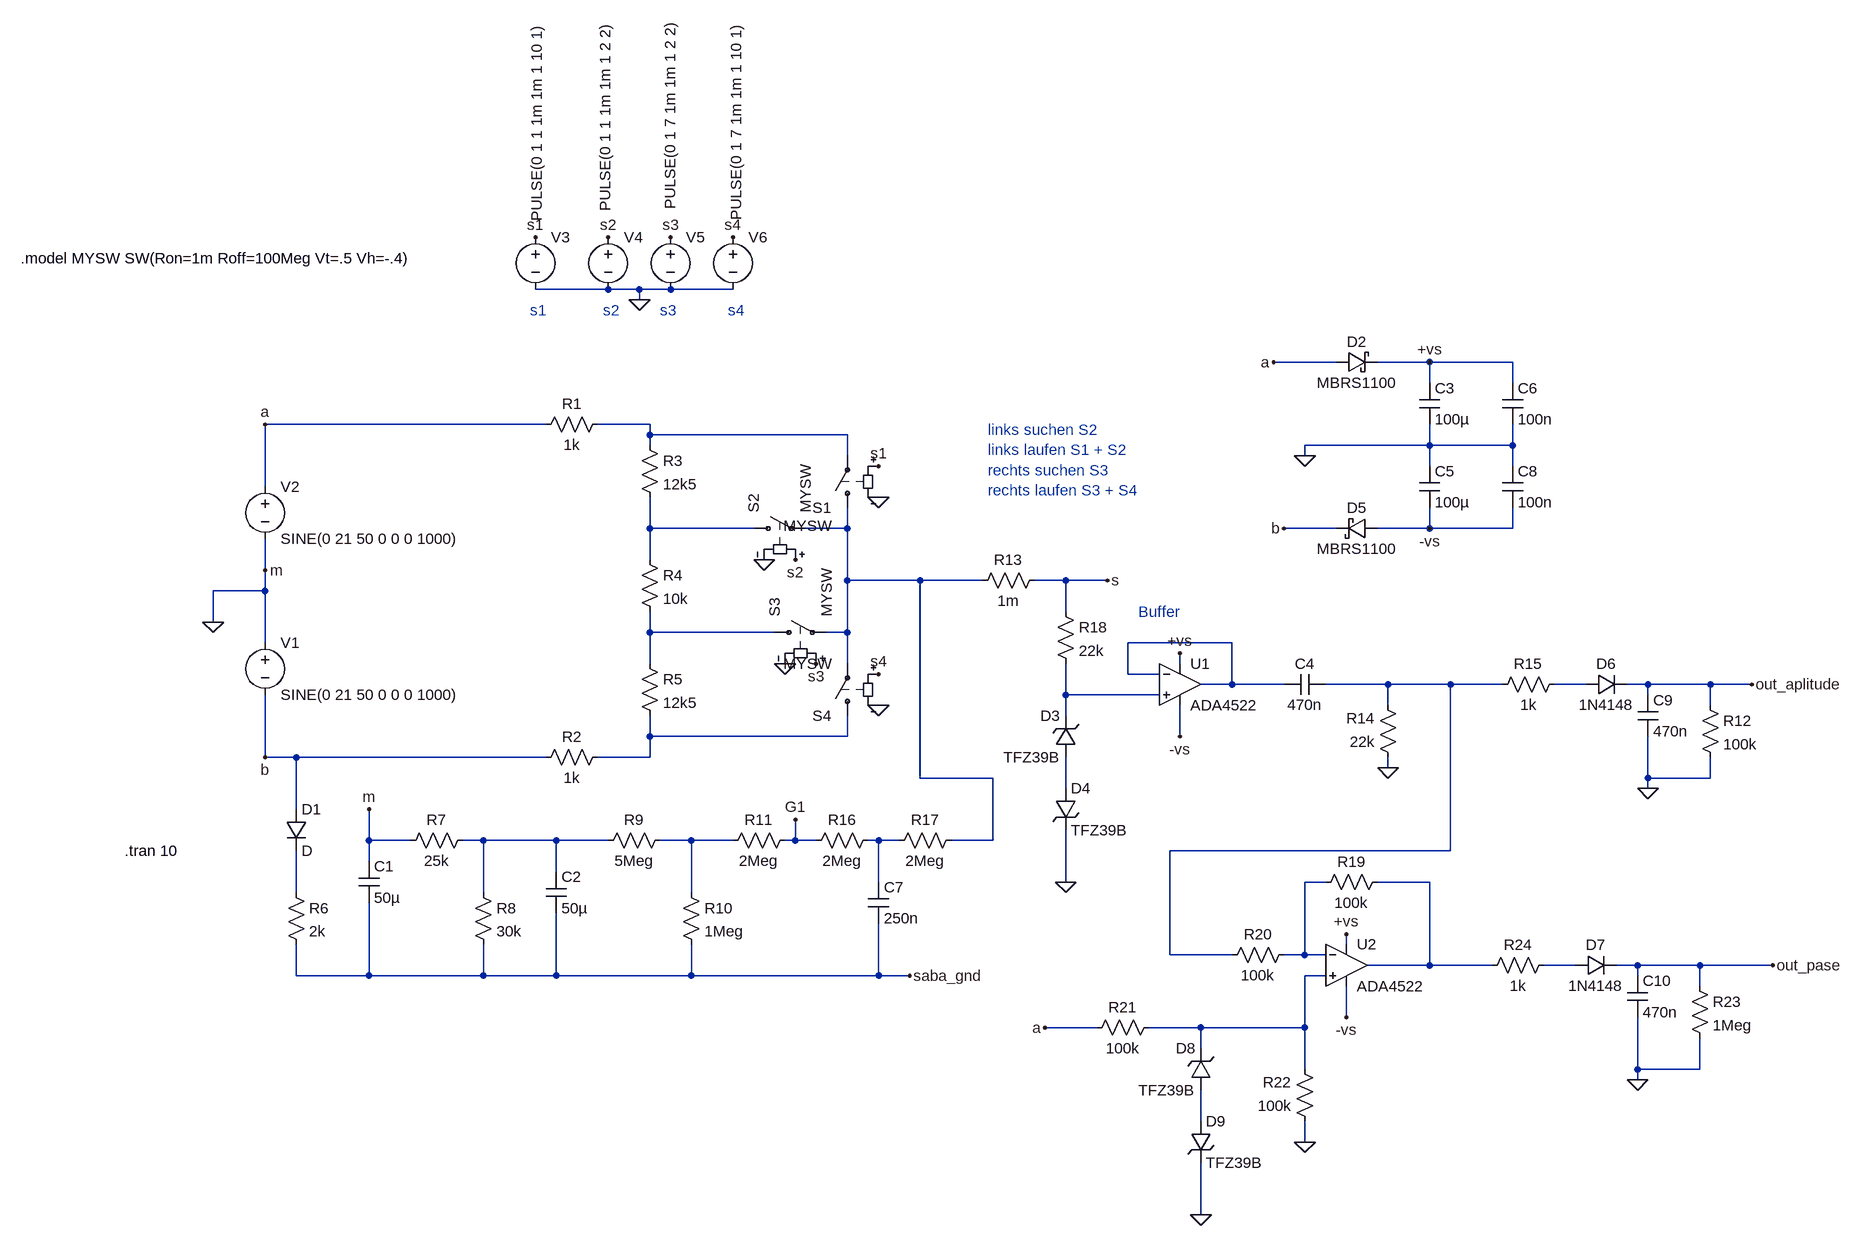
[diagram p0: schematic suchlauf_schalter_digital.asc]
suchlauf_schalter_digital.asc, the LTspice schematic file:
Version 4
SHEET 1 2972 1124
WIRE 592 -320 480 -320
WIRE 640 -320 592 -320
WIRE 688 -320 640 -320
WIRE 784 -320 688 -320
WIRE 640 -304 640 -320
WIRE 1712 -208 1616 -208
WIRE 1856 -208 1776 -208
WIRE 1984 -208 1856 -208
WIRE 1856 -176 1856 -208
WIRE 1984 -176 1984 -208
WIRE 496 -112 64 -112
WIRE 656 -112 576 -112
WIRE 656 -96 656 -112
WIRE 960 -96 656 -96
WIRE 656 -80 656 -96
WIRE 1856 -80 1856 -112
WIRE 1856 -80 1664 -80
WIRE 1984 -80 1984 -112
WIRE 1984 -80 1856 -80
WIRE 960 -64 960 -96
WIRE 1664 -64 1664 -80
WIRE 1856 -48 1856 -80
WIRE 1984 -48 1984 -80
WIRE 64 -16 64 -112
WIRE 656 48 656 0
WIRE 816 48 656 48
WIRE 960 48 960 16
WIRE 960 48 896 48
WIRE 1712 48 1632 48
WIRE 1856 48 1856 16
WIRE 1856 48 1776 48
WIRE 1984 48 1984 16
WIRE 1984 48 1856 48
WIRE 656 96 656 48
WIRE 64 112 64 64
WIRE 960 128 960 48
WIRE 1072 128 960 128
WIRE 1168 128 1072 128
WIRE 1296 128 1248 128
WIRE 1360 128 1296 128
WIRE 64 144 64 112
WIRE 64 144 -16 144
WIRE 1296 176 1296 128
WIRE -16 192 -16 144
WIRE 656 208 656 176
WIRE 848 208 656 208
WIRE 960 208 960 128
WIRE 960 208 928 208
WIRE 64 224 64 144
WIRE 1552 224 1392 224
WIRE 656 256 656 208
WIRE 960 256 960 208
WIRE 1472 256 1472 240
WIRE 1392 272 1392 224
WIRE 1440 272 1392 272
WIRE 1552 288 1552 224
WIRE 1552 288 1504 288
WIRE 1632 288 1552 288
WIRE 1792 288 1696 288
WIRE 1888 288 1792 288
WIRE 1968 288 1888 288
WIRE 2096 288 2048 288
WIRE 2192 288 2160 288
WIRE 2288 288 2192 288
WIRE 2352 288 2288 288
WIRE 1296 304 1296 256
WIRE 1440 304 1296 304
WIRE 2192 304 2192 288
WIRE 1792 320 1792 288
WIRE 2288 320 2288 288
WIRE 1296 336 1296 304
WIRE 656 368 656 336
WIRE 960 368 960 336
WIRE 960 368 656 368
WIRE 1472 368 1472 320
WIRE 64 400 64 304
WIRE 112 400 64 400
WIRE 496 400 112 400
WIRE 656 400 656 368
WIRE 656 400 576 400
WIRE 1792 416 1792 400
WIRE 1072 432 1072 128
WIRE 1184 432 1072 432
WIRE 2192 432 2192 368
WIRE 2288 432 2288 400
WIRE 2288 432 2192 432
WIRE 1296 448 1296 400
WIRE 2192 448 2192 432
WIRE 112 480 112 400
WIRE 224 528 224 480
WIRE 288 528 224 528
WIRE 400 528 368 528
WIRE 512 528 400 528
WIRE 592 528 512 528
WIRE 720 528 672 528
WIRE 784 528 720 528
WIRE 880 528 880 496
WIRE 880 528 864 528
WIRE 912 528 880 528
WIRE 1008 528 992 528
WIRE 1040 528 1008 528
WIRE 1184 528 1184 432
WIRE 1184 528 1120 528
WIRE 1888 544 1888 288
WIRE 1888 544 1456 544
WIRE 224 560 224 528
WIRE 512 576 512 528
WIRE 1008 592 1008 528
WIRE 1296 592 1296 512
WIRE 1696 592 1664 592
WIRE 1856 592 1776 592
WIRE 112 608 112 544
WIRE 400 608 400 528
WIRE 720 608 720 528
WIRE 1728 688 1728 672
WIRE 1456 704 1456 544
WIRE 1552 704 1456 704
WIRE 1664 704 1664 592
WIRE 1664 704 1632 704
WIRE 1696 704 1664 704
WIRE 1856 720 1856 592
WIRE 1856 720 1760 720
WIRE 1952 720 1856 720
WIRE 2080 720 2032 720
WIRE 2176 720 2144 720
WIRE 2272 720 2176 720
WIRE 2384 720 2272 720
WIRE 112 736 112 688
WIRE 224 736 224 624
WIRE 224 736 112 736
WIRE 400 736 400 688
WIRE 400 736 224 736
WIRE 512 736 512 640
WIRE 512 736 400 736
WIRE 720 736 720 688
WIRE 720 736 512 736
WIRE 1008 736 1008 656
WIRE 1008 736 720 736
WIRE 1056 736 1008 736
WIRE 1696 736 1664 736
WIRE 2176 736 2176 720
WIRE 2272 752 2272 720
WIRE 1728 800 1728 752
WIRE 1344 816 1264 816
WIRE 1504 816 1424 816
WIRE 1664 816 1664 736
WIRE 1664 816 1504 816
WIRE 1504 848 1504 816
WIRE 1664 880 1664 816
WIRE 2176 880 2176 800
WIRE 2272 880 2272 832
WIRE 2272 880 2176 880
WIRE 2176 896 2176 880
WIRE 1504 960 1504 912
WIRE 1664 992 1664 960
WIRE 1504 1104 1504 1024
FLAG 64 112 m
FLAG 64 -112 a
FLAG 64 400 b
FLAG 1360 128 s
FLAG 1616 -208 a
FLAG 1856 -208 +vs
FLAG 1472 240 +vs
FLAG 2352 288 out_aplitude
FLAG 1792 416 0
FLAG 224 480 m
FLAG 880 496 G1
FLAG 1056 736 saba_gnd
FLAG -16 192 0
FLAG 1296 592 0
FLAG 1664 -64 0
FLAG 1632 48 b
FLAG 1856 48 -vs
FLAG 1472 368 -vs
FLAG 2192 448 0
FLAG 1728 672 +vs
FLAG 1728 800 -vs
FLAG 1664 992 0
FLAG 2384 720 out_pase
FLAG 2176 896 0
FLAG 1264 816 a
FLAG 1504 1104 0
FLAG 1008 0 0
FLAG 832 96 0
FLAG 864 256 0
FLAG 1008 320 0
FLAG 640 -304 0
FLAG 1008 -48 s1
FLAG 880 96 s2
FLAG 912 256 s3
FLAG 1008 272 s4
FLAG 480 -400 s1
FLAG 592 -400 s2
FLAG 688 -400 s3
FLAG 784 -400 s4
SYMBOL voltage 64 208 R0
WINDOW 123 0 0 Left 0
WINDOW 39 0 0 Left 0
SYMATTR InstName V1
SYMATTR Value SINE(0 21 50 0 0 0 1000)
SYMBOL voltage 64 -32 R0
WINDOW 123 0 0 Left 0
WINDOW 39 0 0 Left 0
SYMATTR InstName V2
SYMATTR Value SINE(0 21 50 0 0 0 1000)
SYMBOL schottky 1712 -192 R270
WINDOW 0 32 32 VTop 2
WINDOW 3 0 32 VBottom 2
SYMATTR InstName D2
SYMATTR Value MBRS1100
SYMATTR Description Diode
SYMATTR Type diode
SYMBOL cap 1840 -176 R0
SYMATTR InstName C3
SYMATTR Value 100µ
SYMBOL Opamps\\ADA4522 1472 224 R0
SYMATTR InstName U1
SYMBOL cap 1968 -176 R0
SYMATTR InstName C6
SYMATTR Value 100n
SYMBOL res 1264 112 R90
WINDOW 0 0 56 VBottom 2
WINDOW 3 32 56 VTop 2
SYMATTR InstName R13
SYMATTR Value 1m
SYMBOL diode 2096 304 R270
WINDOW 0 32 32 VTop 2
WINDOW 3 0 32 VBottom 2
SYMATTR InstName D6
SYMATTR Value 1N4148
SYMBOL cap 2176 304 R0
SYMATTR InstName C9
SYMATTR Value 470n
SYMBOL res 2272 304 R0
SYMATTR InstName R12
SYMATTR Value 100k
SYMBOL zener 1312 400 R180
WINDOW 0 24 64 Left 2
WINDOW 3 24 0 Left 2
SYMATTR InstName D3
SYMATTR Value TFZ39B
SYMBOL cap 1696 272 R90
WINDOW 0 0 32 VBottom 2
WINDOW 3 32 32 VTop 2
SYMATTR InstName C4
SYMATTR Value 470n
SYMBOL res 1808 416 R180
WINDOW 0 36 76 Left 2
WINDOW 3 36 40 Left 2
SYMATTR InstName R14
SYMATTR Value 22k
SYMBOL res 592 -128 R90
WINDOW 0 0 56 VBottom 2
WINDOW 3 32 56 VTop 2
SYMATTR InstName R1
SYMATTR Value 1k
SYMBOL res 592 384 R90
WINDOW 0 0 56 VBottom 2
WINDOW 3 32 56 VTop 2
SYMATTR InstName R2
SYMATTR Value 1k
SYMBOL res 640 -96 R0
SYMATTR InstName R3
SYMATTR Value 12k5
SYMBOL res 640 80 R0
SYMATTR InstName R4
SYMATTR Value 10k
SYMBOL res 640 240 R0
SYMATTR InstName R5
SYMATTR Value 12k5
SYMBOL diode 96 480 R0
SYMATTR InstName D1
SYMBOL res 96 592 R0
SYMATTR InstName R6
SYMATTR Value 2k
SYMBOL cap 208 560 R0
SYMATTR InstName C1
SYMATTR Value 50µ
SYMBOL res 384 512 R90
WINDOW 0 0 56 VBottom 2
WINDOW 3 32 56 VTop 2
SYMATTR InstName R7
SYMATTR Value 25k
SYMBOL res 384 592 R0
SYMATTR InstName R8
SYMATTR Value 30k
SYMBOL res 688 512 R90
WINDOW 0 0 56 VBottom 2
WINDOW 3 32 56 VTop 2
SYMATTR InstName R9
SYMATTR Value 5Meg
SYMBOL res 704 592 R0
SYMATTR InstName R10
SYMATTR Value 1Meg
SYMBOL res 880 512 R90
WINDOW 0 0 56 VBottom 2
WINDOW 3 32 56 VTop 2
SYMATTR InstName R11
SYMATTR Value 2Meg
SYMBOL cap 496 576 R0
SYMATTR InstName C2
SYMATTR Value 50µ
SYMBOL res 1008 512 R90
WINDOW 0 0 56 VBottom 2
WINDOW 3 32 56 VTop 2
SYMATTR InstName R16
SYMATTR Value 2Meg
SYMBOL res 1136 512 R90
WINDOW 0 0 56 VBottom 2
WINDOW 3 32 56 VTop 2
SYMATTR InstName R17
SYMATTR Value 2Meg
SYMBOL cap 992 592 R0
SYMATTR InstName C7
SYMATTR Value 250n
SYMBOL zener 1280 448 R0
SYMATTR InstName D4
SYMATTR Value TFZ39B
SYMBOL schottky 1776 32 R90
WINDOW 0 0 32 VBottom 2
WINDOW 3 32 32 VTop 2
SYMATTR InstName D5
SYMATTR Value MBRS1100
SYMATTR Description Diode
SYMATTR Type diode
SYMBOL cap 1840 -48 R0
SYMATTR InstName C5
SYMATTR Value 100µ
SYMBOL cap 1968 -48 R0
SYMATTR InstName C8
SYMATTR Value 100n
SYMBOL res 2064 272 R90
WINDOW 0 0 56 VBottom 2
WINDOW 3 32 56 VTop 2
SYMATTR InstName R15
SYMATTR Value 1k
SYMBOL res 1280 160 R0
SYMATTR InstName R18
SYMATTR Value 22k
SYMBOL Opamps\\ADA4522 1728 656 R0
SYMATTR InstName U2
SYMBOL res 1792 576 R90
WINDOW 0 0 56 VBottom 2
WINDOW 3 32 56 VTop 2
SYMATTR InstName R19
SYMATTR Value 100k
SYMBOL res 1648 688 R90
WINDOW 0 0 56 VBottom 2
WINDOW 3 32 56 VTop 2
SYMATTR InstName R20
SYMATTR Value 100k
SYMBOL res 1440 800 R90
WINDOW 0 0 56 VBottom 2
WINDOW 3 32 56 VTop 2
SYMATTR InstName R21
SYMATTR Value 100k
SYMBOL res 1680 976 R180
WINDOW 0 36 76 Left 2
WINDOW 3 36 40 Left 2
SYMATTR InstName R22
SYMATTR Value 100k
SYMBOL diode 2080 736 R270
WINDOW 0 32 32 VTop 2
WINDOW 3 0 32 VBottom 2
SYMATTR InstName D7
SYMATTR Value 1N4148
SYMBOL cap 2160 736 R0
SYMATTR InstName C10
SYMATTR Value 470n
SYMBOL res 2256 736 R0
SYMATTR InstName R23
SYMATTR Value 1Meg
SYMBOL res 2048 704 R90
WINDOW 0 0 56 VBottom 2
WINDOW 3 32 56 VTop 2
SYMATTR InstName R24
SYMATTR Value 1k
SYMBOL zener 1520 912 R180
WINDOW 0 24 64 Left 2
WINDOW 3 24 0 Left 2
SYMATTR InstName D8
SYMATTR Value TFZ39B
SYMBOL zener 1488 960 R0
SYMATTR InstName D9
SYMATTR Value TFZ39B
SYMBOL sw 960 32 R180
WINDOW 3 24 -12 Left 2
SYMATTR Value MYSW
SYMATTR InstName S1
SYMBOL sw 800 48 R270
SYMATTR InstName S2
SYMATTR Value MYSW
SYMBOL sw 832 208 R270
SYMATTR InstName S3
SYMATTR Value MYSW
SYMBOL sw 960 352 R180
SYMATTR InstName S4
SYMATTR Value MYSW
SYMBOL voltage 480 -416 R0
WINDOW 3 2 -312 VRight 2
WINDOW 123 0 0 Left 0
WINDOW 39 0 0 Left 0
SYMATTR Value PULSE(0 1 1 1m 1m 1 10 1)
SYMATTR InstName V3
SYMBOL voltage 592 -416 R0
WINDOW 3 -5 -314 VRight 2
WINDOW 123 0 0 Left 0
WINDOW 39 0 0 Left 0
SYMATTR Value PULSE(0 1 1 1m 1m 1 2 2)
SYMATTR InstName V4
SYMBOL voltage 688 -416 R0
WINDOW 3 -1 -317 VRight 2
WINDOW 123 0 0 Left 0
WINDOW 39 0 0 Left 0
SYMATTR Value PULSE(0 1 7 1m 1m 1 2 2)
SYMATTR InstName V5
SYMBOL voltage 784 -416 R0
WINDOW 3 5 -313 VRight 2
WINDOW 123 0 0 Left 0
WINDOW 39 0 0 Left 0
SYMATTR Value PULSE(0 1 7 1m 1m 1 10 1)
SYMATTR InstName V6
TEXT -152 544 Left 2 !.tran 10
TEXT 1176 -104 Left 2 ;links suchen S2\nlinks laufen S1 + S2\nrechts suchen S3\nrechts laufen S3 + S4
TEXT 1408 176 Left 2 ;Buffer
TEXT 472 -288 Left 2 ;s1
TEXT 584 -288 Left 2 ;s2
TEXT 672 -288 Left 2 ;s3
TEXT 776 -288 Left 2 ;s4
TEXT -312 -368 Left 2 !.model MYSW SW(Ron=1m Roff=100Meg Vt=.5 Vh=-.4)

The netlist it stands for:
* suchlauf_schalter_digital.asc
V1 0 b SINE(0 21 50 0 0 0 1000)
V2 a 0 SINE(0 21 50 0 0 0 1000)
D2 a +vs MBRS1100
C3 +vs 0 100µ
XU1 N008 N005 +vs -vs N005 ADA4522  ; pins In+ In- V+ V- OUT
C6 +vs 0 100n
R13 s N003 1m
D6 N007 out_aplitude 1N4148
C9 out_aplitude 0 470n
R12 out_aplitude 0 100k
D3 N010 N008 TFZ39B
C4 N006 N005 470n
R14 0 N006 22k
R1 N001 a 1k
R2 N009 b 1k
R3 N001 N002 12k5
R4 N002 N004 10k
R5 N004 N009 12k5
D1 b N016 D
R6 N016 saba_gnd 2k
C1 0 saba_gnd 50µ
R7 N011 0 25k
R8 N011 saba_gnd 30k
R9 N012 N011 5Meg
R10 N012 saba_gnd 1Meg
R11 G1 N012 2Meg
C2 N011 saba_gnd 50µ
R16 N013 G1 2Meg
R17 N003 N013 2Meg
C7 N013 saba_gnd 250n
D4 N010 0 TFZ39B
D5 -vs b MBRS1100
C5 0 -vs 100µ
C8 0 -vs 100n
R15 N007 N006 1k
R18 s N008 22k
XU2 N018 N014 +vs -vs N015 ADA4522  ; pins In+ In- V+ V- OUT
R19 N015 N014 100k
R20 N014 N006 100k
R21 N018 a 100k
R22 0 N018 100k
D7 N017 out_pase 1N4148
C10 out_pase 0 470n
R23 out_pase 0 1Meg
R24 N017 N015 1k
D8 N019 N018 TFZ39B
D9 N019 0 TFZ39B
S1 N003 N001 s1 0 MYSW
S2 N002 N003 s2 0 MYSW
S3 N004 N003 s3 0 MYSW
S4 N009 N003 s4 0 MYSW
V3 s1 0 PULSE(0 1 1 1m 1m 1 10 1)
V4 s2 0 PULSE(0 1 1 1m 1m 1 2 2)
V5 s3 0 PULSE(0 1 7 1m 1m 1 2 2)
V6 s4 0 PULSE(0 1 7 1m 1m 1 10 1)
.model D D
.lib standard.dio
.tran 10
* links suchen S2
* links laufen S1 + S2
* rechts suchen S3
* rechts laufen S3 + S4
* Buffer
* s1
* s2
* s3
* s4
.model MYSW SW(Ron=1m Roff=100Meg Vt=.5 Vh=-.4)
.backanno
.end